# EAGLE design untitled (EAGLE 9.1.3)

## Sheet 1 of 2
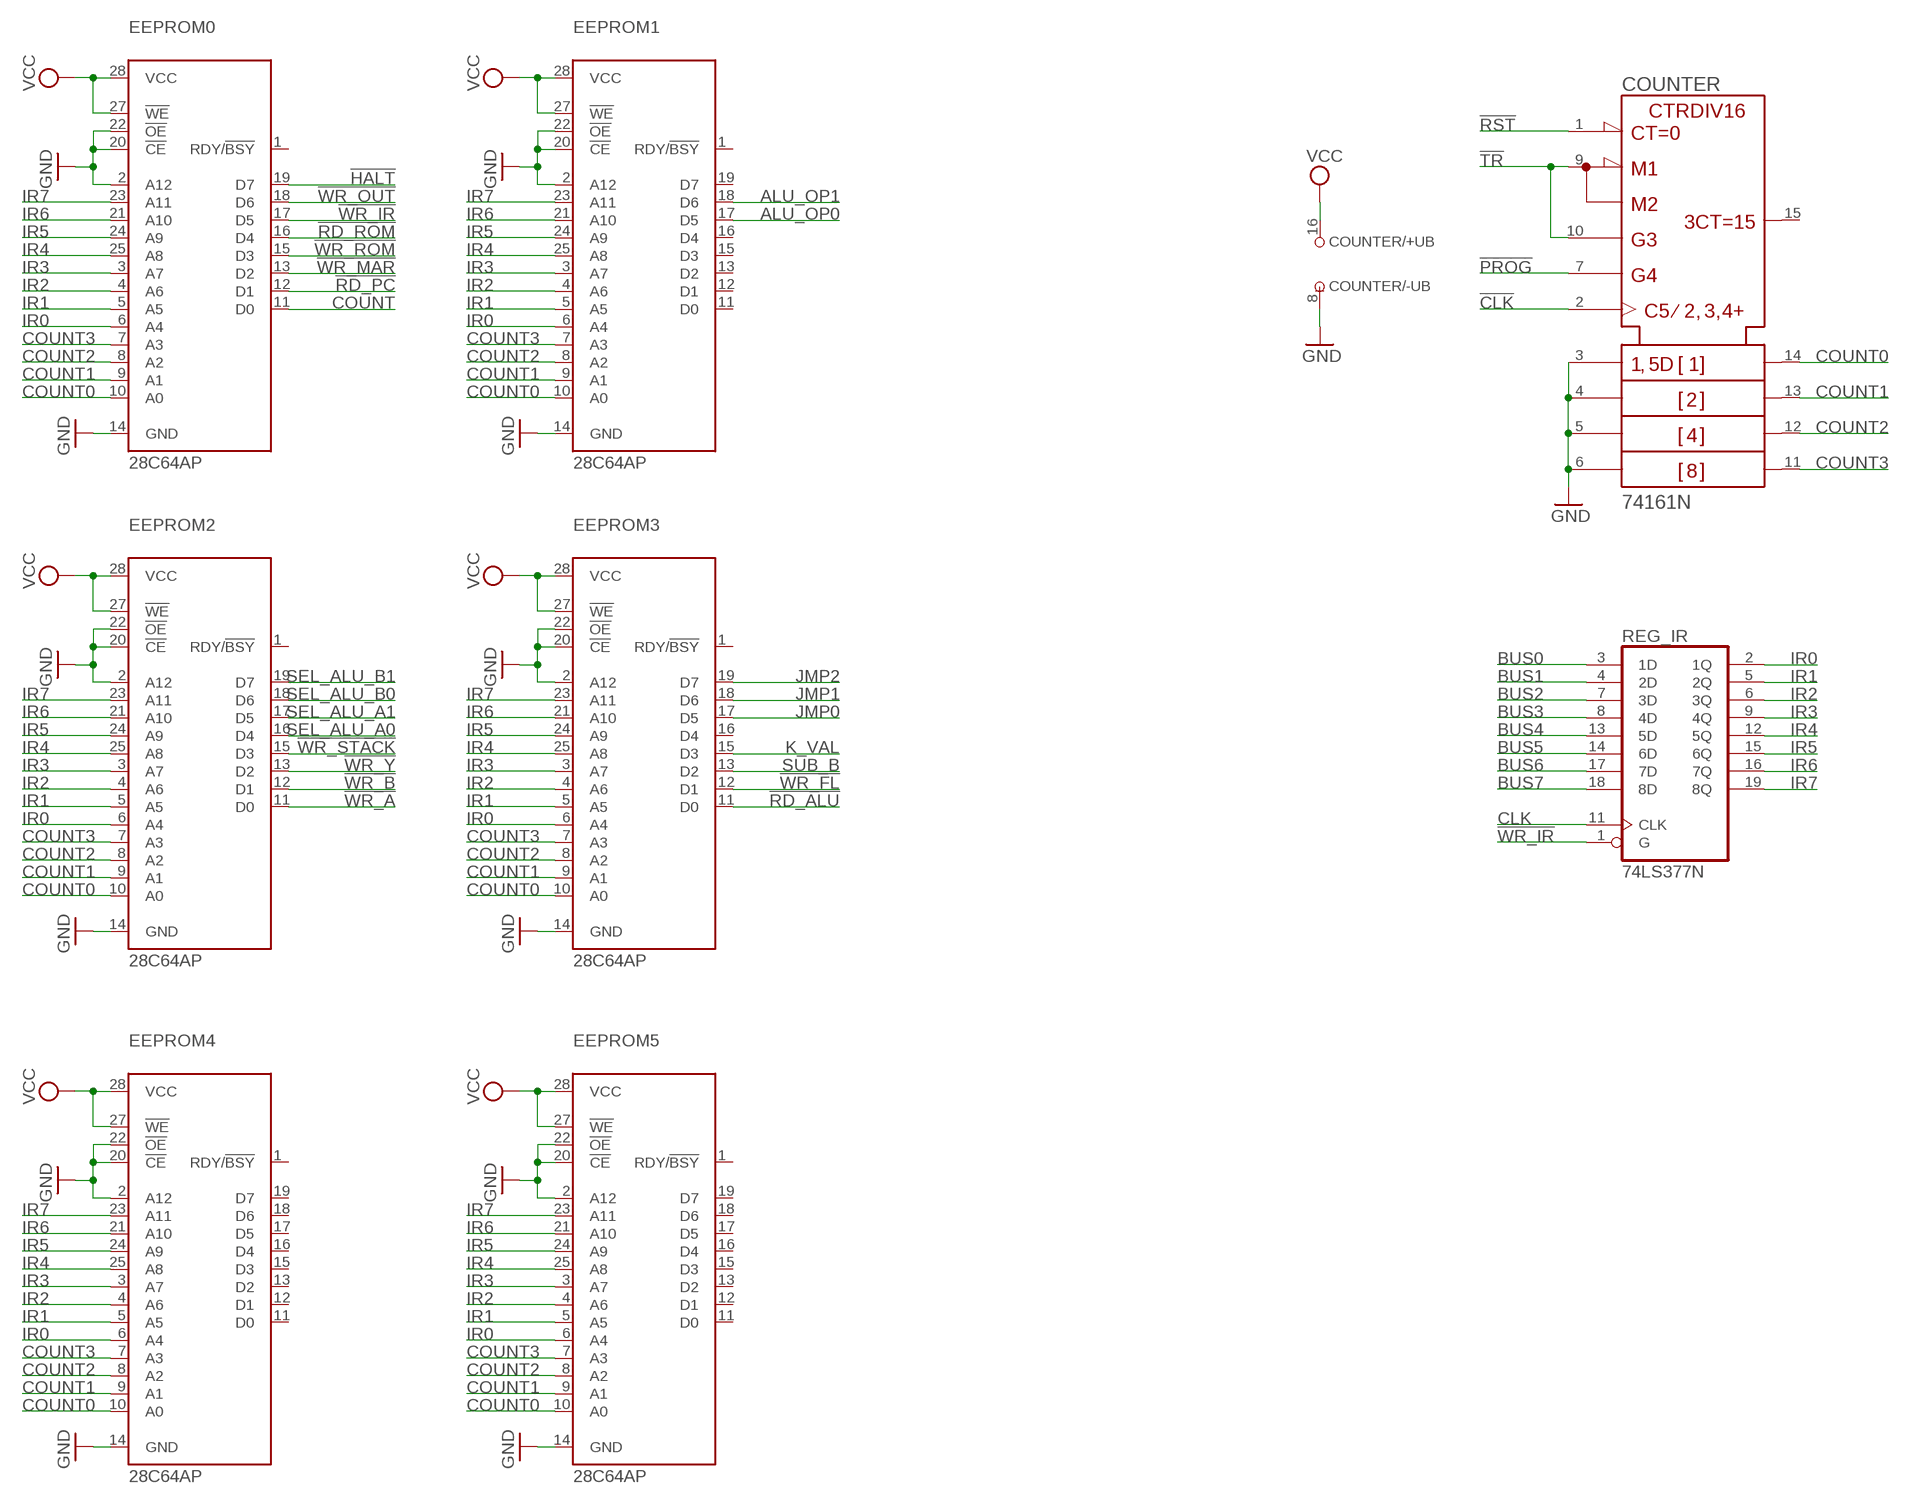
[diagram p0: schematic, sheet 1, part 1 of 2]
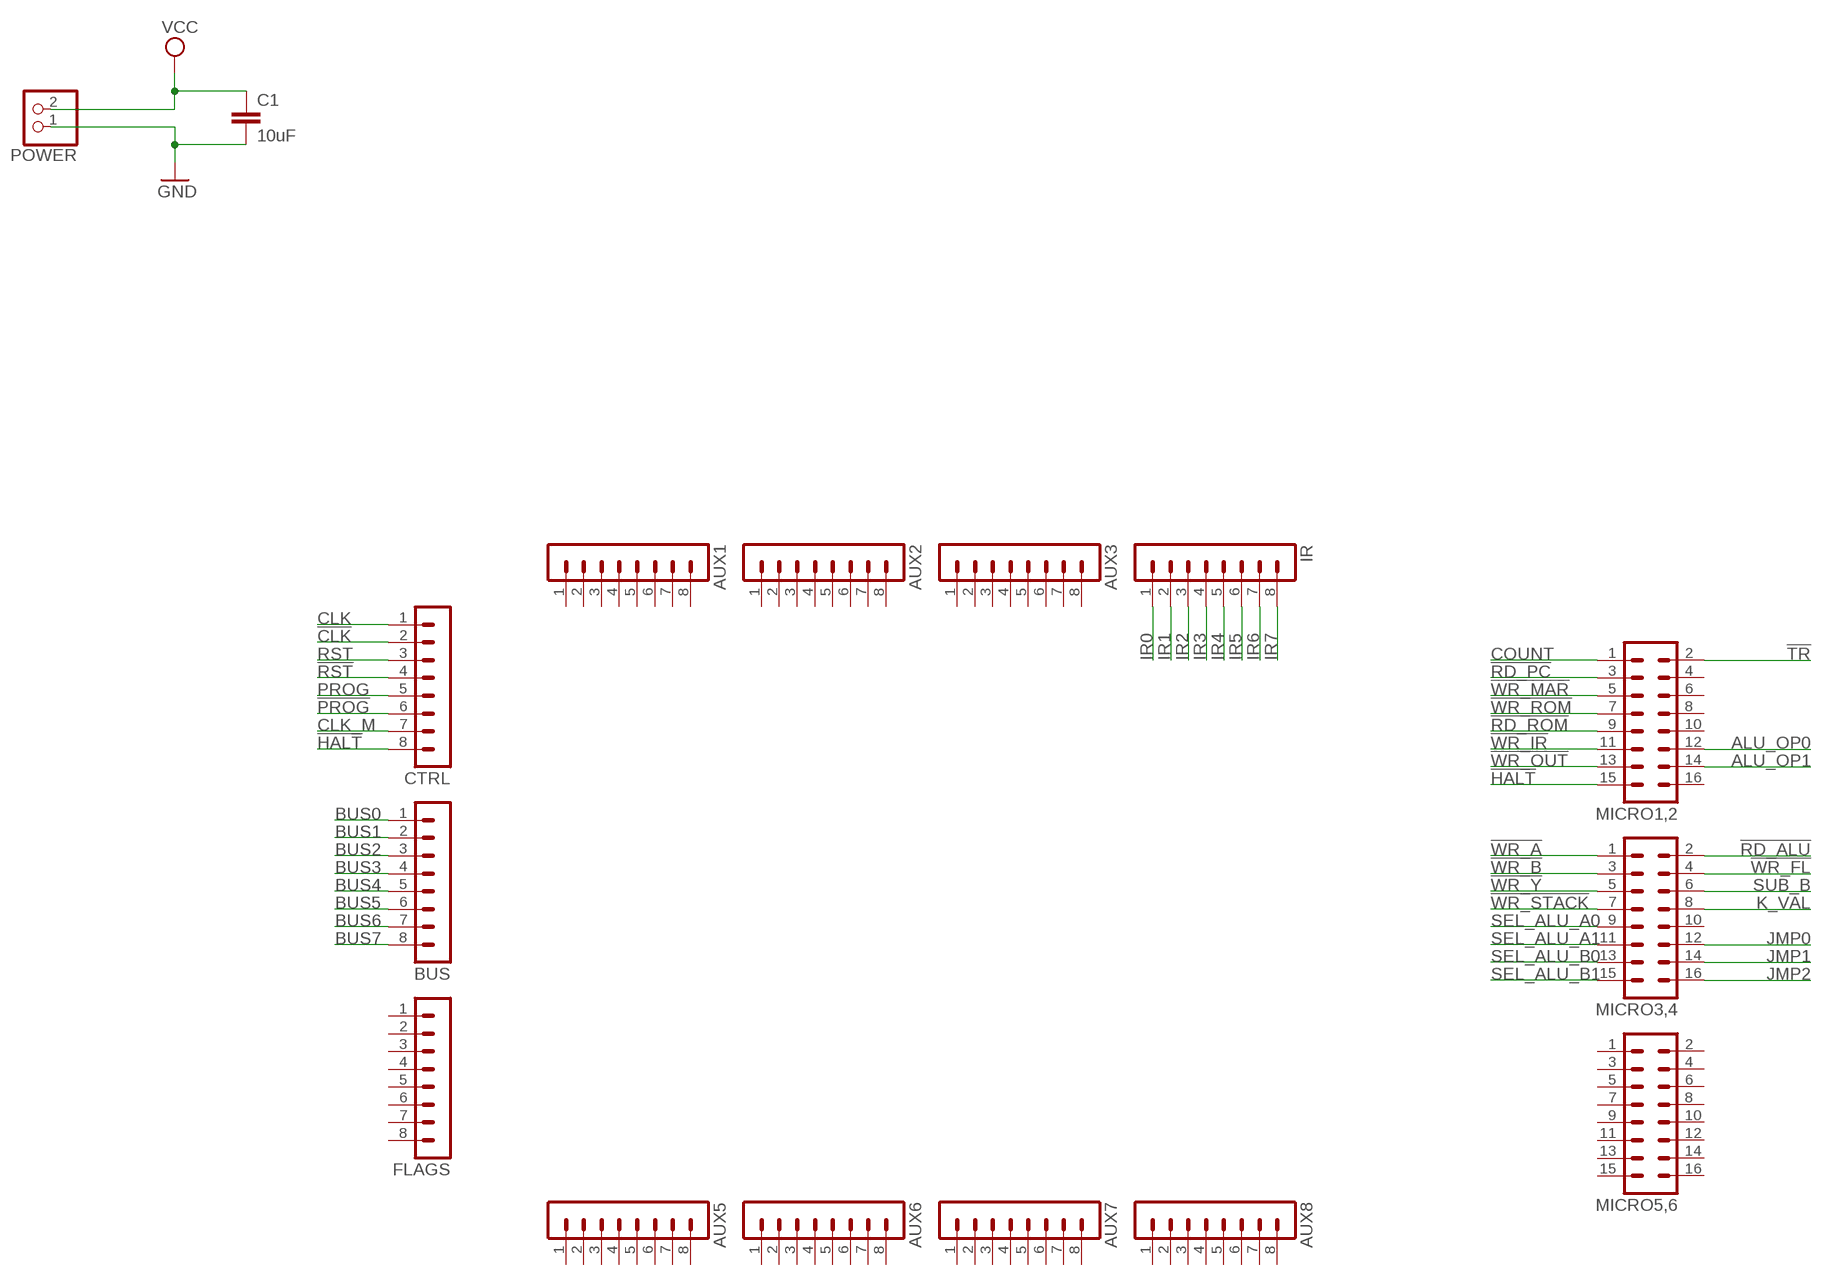
[diagram p1: schematic, sheet 1, part 2 of 2]

### Parts
AUX1  MA08-1  [MA08-1]
AUX2  MA08-1  [MA08-1]
AUX3  MA08-1  [MA08-1]
AUX5  MA08-1  [MA08-1]
AUX6  MA08-1  [MA08-1]
AUX7  MA08-1  [MA08-1]
AUX8  MA08-1  [MA08-1]
BUS  MA08-1  [MA08-1]
C1  10uF  C-EU025-050X050  [C025-050X050]
COUNTER  74161N  [DIL16]
CTRL  MA08-1  [MA08-1]
EEPROM0  28C64AP  [DIL28-6]
EEPROM1  28C64AP  [DIL28-6]
EEPROM2  28C64AP  [DIL28-6]
EEPROM3  28C64AP  [DIL28-6]
EEPROM4  28C64AP  [DIL28-6]
EEPROM5  28C64AP  [DIL28-6]
FLAGS  MA08-1  [MA08-1]
IR  MA08-1  [MA08-1]
MICRO1,2  MA08-2  [MA08-2]
MICRO3,4  MA08-2  [MA08-2]
MICRO5,6  MA08-2  [MA08-2]
POWER  PINHD-1X2  [1X02]
REG_IR  74LS377N  [DIL20]

### Nets
!CLK: COUNTER.2(CLK) CTRL.2
!HALT: CTRL.8 EEPROM0.19(D7) MICRO1,2.15
!PROG: COUNTER.7(ENP) CTRL.6
!RD_ALU: EEPROM3.11(D0) MICRO3,4.2
!RD_PC: EEPROM0.12(D1) MICRO1,2.3
!RD_ROM: EEPROM0.16(D4) MICRO1,2.9
!RST: COUNTER.1(!CLR) CTRL.4
!TR: COUNTER.9(!LOAD) COUNTER.10(ENT) MICRO1,2.2
!WR_A: EEPROM2.11(D0) MICRO3,4.1
!WR_B: EEPROM2.12(D1) MICRO3,4.3
!WR_FL: EEPROM3.12(D1) MICRO3,4.4
!WR_IR: EEPROM0.17(D5) MICRO1,2.11 REG_IR.1(G)
!WR_MAR: EEPROM0.13(D2) MICRO1,2.5
!WR_OUT: EEPROM0.18(D6) MICRO1,2.13
!WR_ROM: EEPROM0.15(D3) MICRO1,2.7
!WR_STACK: EEPROM2.15(D3) MICRO3,4.7
!WR_Y: EEPROM2.13(D2) MICRO3,4.5
ALU_OP0: EEPROM1.17(D5) MICRO1,2.12
ALU_OP1: EEPROM1.18(D6) MICRO1,2.14
BUS0: BUS.1 REG_IR.3(1D)
BUS1: BUS.2 REG_IR.4(2D)
BUS2: BUS.3 REG_IR.7(3D)
BUS3: BUS.4 REG_IR.8(4D)
BUS4: BUS.5 REG_IR.13(5D)
BUS5: BUS.6 REG_IR.14(6D)
BUS6: BUS.7 REG_IR.17(7D)
BUS7: BUS.8 REG_IR.18(8D)
CLK: CTRL.1 REG_IR.11(CLK)
CLK_M: CTRL.7
COUNT: EEPROM0.11(D0) MICRO1,2.1
COUNT0: COUNTER.14(QA) EEPROM0.10(A0) EEPROM1.10(A0) EEPROM2.10(A0) EEPROM3.10(A0) EEPROM4.10(A0) EEPROM5.10(A0)
COUNT1: COUNTER.13(QB) EEPROM0.9(A1) EEPROM1.9(A1) EEPROM2.9(A1) EEPROM3.9(A1) EEPROM4.9(A1) EEPROM5.9(A1)
COUNT2: COUNTER.12(QC) EEPROM0.8(A2) EEPROM1.8(A2) EEPROM2.8(A2) EEPROM3.8(A2) EEPROM4.8(A2) EEPROM5.8(A2)
COUNT3: COUNTER.11(QD) EEPROM0.7(A3) EEPROM1.7(A3) EEPROM2.7(A3) EEPROM3.7(A3) EEPROM4.7(A3) EEPROM5.7(A3)
GND: C1.2 COUNTER.3(A) COUNTER.4(B) COUNTER.5(C) COUNTER.6(D) COUNTER.8(-UB) EEPROM0.2(A12) EEPROM0.14(GND) EEPROM0.20(!CE) EEPROM0.22(!OE) EEPROM1.2(A12) EEPROM1.14(GND) EEPROM1.20(!CE) EEPROM1.22(!OE) EEPROM2.2(A12) EEPROM2.14(GND) EEPROM2.20(!CE) EEPROM2.22(!OE) EEPROM3.2(A12) EEPROM3.14(GND) EEPROM3.20(!CE) EEPROM3.22(!OE) EEPROM4.2(A12) EEPROM4.14(GND) EEPROM4.20(!CE) EEPROM4.22(!OE) EEPROM5.2(A12) EEPROM5.14(GND) EEPROM5.20(!CE) EEPROM5.22(!OE) POWER.1
IR0: EEPROM0.6(A4) EEPROM1.6(A4) EEPROM2.6(A4) EEPROM3.6(A4) EEPROM4.6(A4) EEPROM5.6(A4) IR.1 REG_IR.2(1Q)
IR1: EEPROM0.5(A5) EEPROM1.5(A5) EEPROM2.5(A5) EEPROM3.5(A5) EEPROM4.5(A5) EEPROM5.5(A5) IR.2 REG_IR.5(2Q)
IR2: EEPROM0.4(A6) EEPROM1.4(A6) EEPROM2.4(A6) EEPROM3.4(A6) EEPROM4.4(A6) EEPROM5.4(A6) IR.3 REG_IR.6(3Q)
IR3: EEPROM0.3(A7) EEPROM1.3(A7) EEPROM2.3(A7) EEPROM3.3(A7) EEPROM4.3(A7) EEPROM5.3(A7) IR.4 REG_IR.9(4Q)
IR4: EEPROM0.25(A8) EEPROM1.25(A8) EEPROM2.25(A8) EEPROM3.25(A8) EEPROM4.25(A8) EEPROM5.25(A8) IR.5 REG_IR.12(5Q)
IR5: EEPROM0.24(A9) EEPROM1.24(A9) EEPROM2.24(A9) EEPROM3.24(A9) EEPROM4.24(A9) EEPROM5.24(A9) IR.6 REG_IR.15(6Q)
IR6: EEPROM0.21(A10) EEPROM1.21(A10) EEPROM2.21(A10) EEPROM3.21(A10) EEPROM4.21(A10) EEPROM5.21(A10) IR.7 REG_IR.16(7Q)
IR7: EEPROM0.23(A11) EEPROM1.23(A11) EEPROM2.23(A11) EEPROM3.23(A11) EEPROM4.23(A11) EEPROM5.23(A11) IR.8 REG_IR.19(8Q)
JMP0: EEPROM3.17(D5) MICRO3,4.12
JMP1: EEPROM3.18(D6) MICRO3,4.14
JMP2: EEPROM3.19(D7) MICRO3,4.16
K_VAL: EEPROM3.15(D3) MICRO3,4.8
PROG: CTRL.5
RST: CTRL.3
SEL_ALU_A0: EEPROM2.16(D4) MICRO3,4.9
SEL_ALU_A1: EEPROM2.17(D5) MICRO3,4.11
SEL_ALU_B0: EEPROM2.18(D6) MICRO3,4.13
SEL_ALU_B1: EEPROM2.19(D7) MICRO3,4.15
SUB_B: EEPROM3.13(D2) MICRO3,4.6
VCC: C1.1 COUNTER.16(+UB) EEPROM0.27(!WE) EEPROM0.28(VCC) EEPROM1.27(!WE) EEPROM1.28(VCC) EEPROM2.27(!WE) EEPROM2.28(VCC) EEPROM3.27(!WE) EEPROM3.28(VCC) EEPROM4.27(!WE) EEPROM4.28(VCC) EEPROM5.27(!WE) EEPROM5.28(VCC) POWER.2
Unconnected: AUX1.1 AUX1.2 AUX1.3 AUX1.4 AUX1.5 AUX1.6 AUX1.7 AUX1.8 AUX2.1 AUX2.2 AUX2.3 AUX2.4 AUX2.5 AUX2.6 AUX2.7 AUX2.8 AUX3.1 AUX3.2 AUX3.3 AUX3.4 AUX3.5 AUX3.6 AUX3.7 AUX3.8 AUX5.1 AUX5.2 AUX5.3 AUX5.4 AUX5.5 AUX5.6 AUX5.7 AUX5.8 AUX6.1 AUX6.2 AUX6.3 AUX6.4 AUX6.5 AUX6.6 AUX6.7 AUX6.8 AUX7.1 AUX7.2 AUX7.3 AUX7.4 AUX7.5 AUX7.6 AUX7.7 AUX7.8 AUX8.1 AUX8.2 AUX8.3 AUX8.4 AUX8.5 AUX8.6 AUX8.7 AUX8.8 COUNTER.15(RCO) EEPROM0.1(RDY/!BSY) EEPROM1.1(RDY/!BSY) EEPROM1.11(D0) EEPROM1.12(D1) EEPROM1.13(D2) EEPROM1.15(D3) EEPROM1.16(D4) EEPROM1.19(D7) EEPROM2.1(RDY/!BSY) EEPROM3.1(RDY/!BSY) EEPROM3.16(D4) EEPROM4.1(RDY/!BSY) EEPROM4.11(D0) EEPROM4.12(D1) EEPROM4.13(D2) EEPROM4.15(D3) EEPROM4.16(D4) EEPROM4.17(D5) EEPROM4.18(D6) EEPROM4.19(D7) EEPROM5.1(RDY/!BSY) EEPROM5.11(D0) EEPROM5.12(D1) EEPROM5.13(D2) EEPROM5.15(D3) EEPROM5.16(D4) EEPROM5.17(D5) EEPROM5.18(D6) EEPROM5.19(D7) FLAGS.1 FLAGS.2 FLAGS.3 FLAGS.4 FLAGS.5 FLAGS.6 FLAGS.7 FLAGS.8 MICRO1,2.4 MICRO1,2.6 MICRO1,2.8 MICRO1,2.10 MICRO1,2.16 MICRO3,4.10 MICRO5,6.1 MICRO5,6.2 MICRO5,6.3 MICRO5,6.4 MICRO5,6.5 MICRO5,6.6 MICRO5,6.7 MICRO5,6.8 MICRO5,6.9 MICRO5,6.10 MICRO5,6.11 MICRO5,6.12 MICRO5,6.13 MICRO5,6.14 MICRO5,6.15 MICRO5,6.16

## Sheet 2 of 2

## Power pins joined to a net without a drawn wire
GND: REG_IR.10(GND)
VCC: REG_IR.20(VCC)

## Library data of the parts
AUX1-AUX3 AUX5-AUX8 BUS CTRL FLAGS IR = con-lstb:MA08-1: PIN HEADER; OC_FARNELL: unknown; OC_NEWARK: unknown
C1 = rcl:C-EU: CAPACITOR, European symbol; SPICEPREFIX: C
COUNTER = 74ttl-din:74*161: Synchrounus 4-bit COUNTER
EEPROM0 EEPROM1-EEPROM5 = microchip:28*64A: CMOS EEPROM 64 K (8 K x 8), low voltage; MPN: AT28C64B-15PU; OC_FARNELL: 1631144; OC_NEWARK: 96K6557
MICRO1,2 MICRO3,4 MICRO5,6 = con-lstb:MA08-2: PIN HEADER; OC_FARNELL: unknown; OC_NEWARK: unknown
POWER = pinhead:PINHD-1X2: PIN HEADER
REG_IR = 74xx-eu:74*377: Octal D type FLIP FLOP, enable

## Board
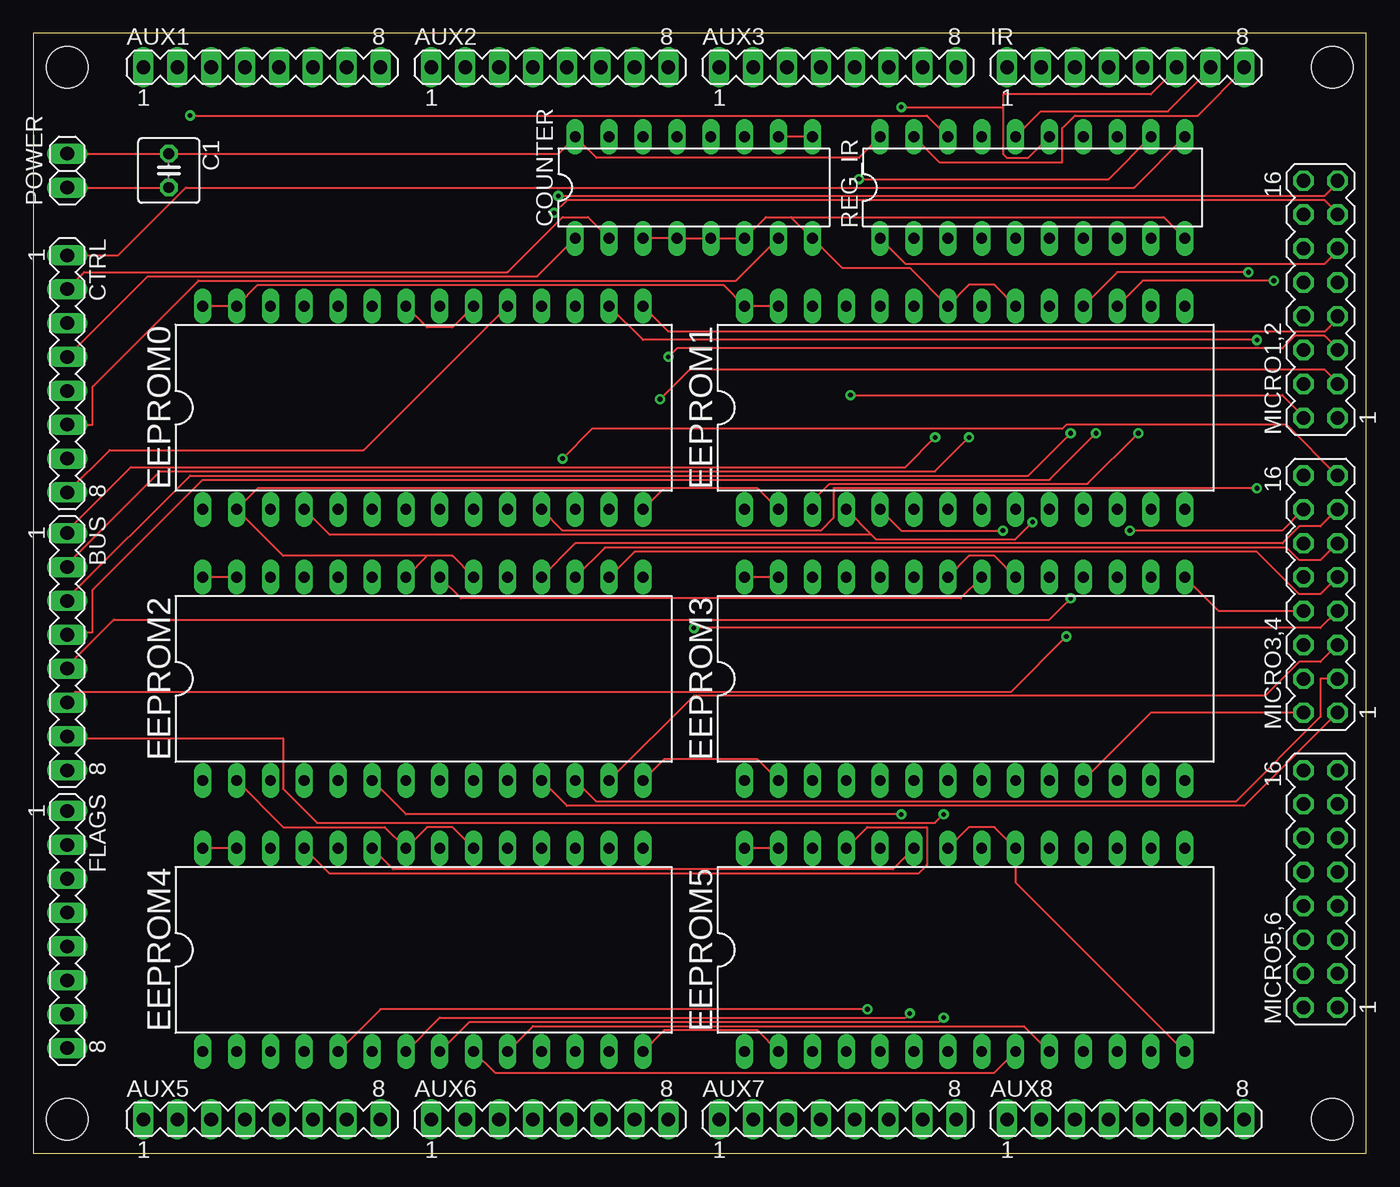
[diagram p2: board, top side]
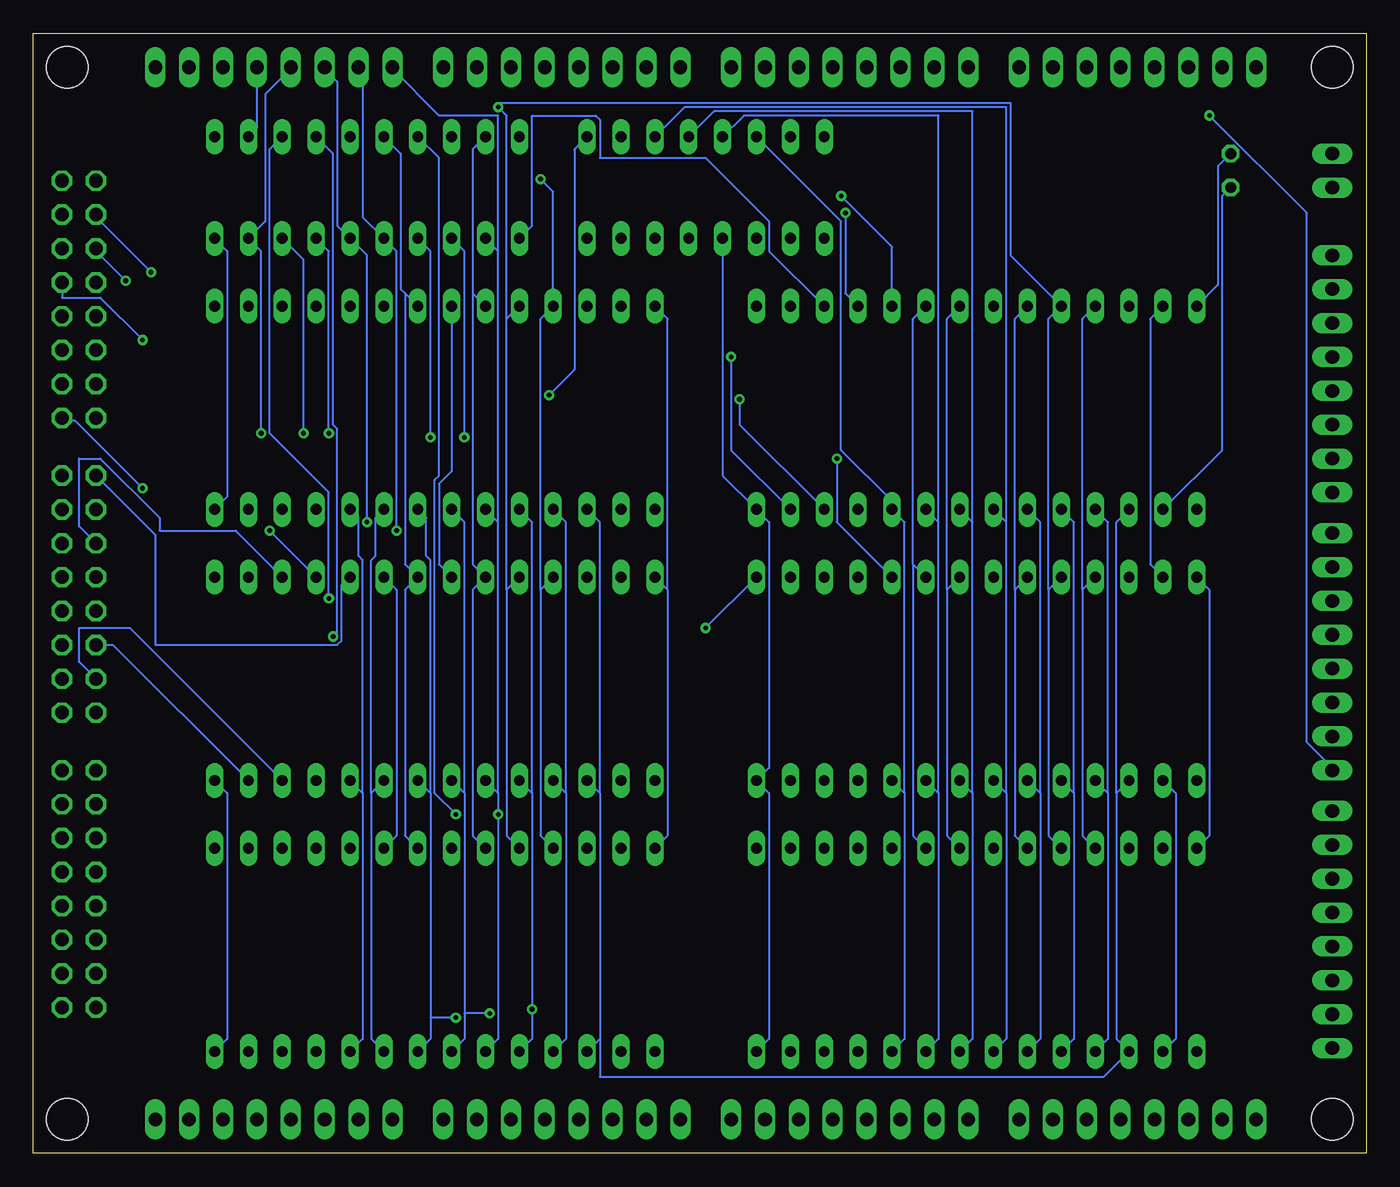
[diagram p3: board, bottom side, seen from below]

Size 99.95 x 83.95 mm. Coordinates in mm from the lower left corner, seen from the top.
Outline: 0,0 99.95,0 99.95,83.95 0,83.95 0,0
Copper layers (1*16): Top 0.035mm / dielectric 1.5mm / Bottom 0.035mm
Design rules "default": minimum track width 6mil, minimum drill 0.35mm, track to track 6mil, track to pad 6mil, pad to pad 6mil, via to via 6mil, smd to smd 6mil, copper to edge 40mil, drill to drill 6mil, minimum pad ring 10mil, minimum via ring 8mil, stop-mask expansion 4mil, vias tented up to drill 0mil, thermal gap 10mil
Holes 3.1 mm at 97.41,81.41 2.54,81.41 97.41,2.54 2.54,2.54

### Footprints (pad centres in the part's own frame; a part is rotated, then mirrored left to right if it is on the bottom)
MA08-1 = drill 1.016 long: 1 -8.89,0; 2 -6.35,0; 3 -3.81,0; 4 -1.27,0; 5 1.27,0; 6 3.81,0; 7 6.35,0; 8 8.89,0
C025-050X050 = drill 0.813 octagon: 1 -1.27,0; 2 1.27,0
DIL16 = drill 0.813 long: 1 -8.89,-3.81; 2 -6.35,-3.81; 3 -3.81,-3.81; 4 -1.27,-3.81; 5 1.27,-3.81; 6 3.81,-3.81; 7 6.35,-3.81; 8 8.89,-3.81; 9 8.89,3.81; 10 6.35,3.81; 11 3.81,3.81; 12 1.27,3.81; 13 -1.27,3.81; 14 -3.81,3.81; 15 -6.35,3.81; 16 -8.89,3.81
DIL28-6 = drill 0.813 long: 1 -16.51,-7.62; 2 -13.97,-7.62; 3 -11.43,-7.62; 4 -8.89,-7.62; 5 -6.35,-7.62; 6 -3.81,-7.62; 7 -1.27,-7.62; 8 1.27,-7.62; 9 3.81,-7.62; 10 6.35,-7.62; 11 8.89,-7.62; 12 11.43,-7.62; 13 13.97,-7.62; 14 16.51,-7.62; 15 16.51,7.62; 16 13.97,7.62; 17 11.43,7.62; 18 8.89,7.62; 19 6.35,7.62; 20 3.81,7.62; 21 1.27,7.62; 22 -1.27,7.62; 23 -3.81,7.62; 24 -6.35,7.62; 25 -8.89,7.62; 26 -11.43,7.62; 27 -13.97,7.62; 28 -16.51,7.62
MA08-2 = drill 1.016 octagon: 1 -8.89,-1.27; 2 -8.89,1.27; 3 -6.35,-1.27; 4 -6.35,1.27; 5 -3.81,-1.27; 6 -3.81,1.27; 7 -1.27,-1.27; 8 -1.27,1.27; 9 1.27,-1.27; 10 1.27,1.27; 11 3.81,-1.27; 12 3.81,1.27; 13 6.35,-1.27; 14 6.35,1.27; 15 8.89,-1.27; 16 8.89,1.27
1X02 = drill 1.016 long: 1 -1.27,0; 2 1.27,0
DIL20 = drill 0.813 long: 1 -11.43,-3.81; 2 -8.89,-3.81; 3 -6.35,-3.81; 4 -3.81,-3.81; 5 -1.27,-3.81; 6 1.27,-3.81; 7 3.81,-3.81; 8 6.35,-3.81; 9 8.89,-3.81; 10 11.43,-3.81; 11 11.43,3.81; 12 8.89,3.81; 13 6.35,3.81; 14 3.81,3.81; 15 1.27,3.81; 16 -1.27,3.81; 17 -3.81,3.81; 18 -6.35,3.81; 19 -8.89,3.81; 20 -11.43,3.81

### Placement (x,y rotation side)
AUX1  17.14,81.41 0 top
AUX2  38.73,81.41 0 top
AUX3  60.33,81.41 0 top
AUX5  17.14,2.54 0 top
AUX6  38.73,2.54 0 top
AUX7  60.33,2.54 0 top
AUX8  81.92,2.54 0 top
BUS  2.54,37.59 270 top
C1  10.16,73.66 270 top
COUNTER  49.53,72.39 0 top
CTRL  2.54,58.42 270 top
EEPROM0  29.21,55.88 0 top
EEPROM1  69.85,55.88 0 top
EEPROM2  29.21,35.56 0 top
EEPROM3  69.85,35.56 0 top
EEPROM4  29.21,15.24 0 top
EEPROM5  69.85,15.24 0 top
FLAGS  2.54,16.76 270 top
IR  81.92,81.41 0 top
MICRO1,2  96.52,64.01 90 top
MICRO3,4  96.52,41.91 90 top
MICRO5,6  96.52,19.81 90 top
POWER  2.54,73.66 90 top
REG_IR  74.93,72.39 0 top

### Tracks (layer width: path | path; a pad name or v marks a point on that pad's centre or on a via)
!CLK
  Top 0.152: COUNTER.2 41.59,70.17 39.69,70.17 35.56,66.04 3.81,66.04 CTRL.2
!HALT  (via drill 0.35)
  Top 0.152: EEPROM0.19 24.77,52.7 5.71,52.7 CTRL.8 | v39.37,71.75 96.84,71.75 97.79,72.71 MICRO1,2.15
  Bottom 0.152: v39.37,71.75 35.56,67.94 EEPROM0.19
!PROG
  Top 0.152: COUNTER.7 52.7,65.41 12.38,65.41 4.45,57.47 4.45,54.61 CTRL.6
!RD_ALU
  Top 0.152: EEPROM3.11 83.82,33.02 MICRO3,4.2
!RD_PC  (via drill 0.35)
  Top 0.152: v46.99,56.52 49.21,58.74 96.84,58.74 97.79,57.78 MICRO1,2.3
  Bottom 0.152: EEPROM0.12 46.99,54.61 v46.99,56.52
!RD_ROM  (via drill 0.35)
  Top 0.152: EEPROM0.16 45.72,60.96 v91.76,60.96
  Bottom 0.152: v91.76,60.96 94.93,64.14 97.79,64.14 MICRO1,2.9
!RST
  Top 0.152: COUNTER.1 37.78,65.72 8.57,65.72 CTRL.4
!TR  (via drill 0.35)
  Top 0.152: COUNTER.9 COUNTER.10 | v61.28,56.83 93.66,56.83 95.25,55.24 MICRO1,2.2
  Bottom 0.152: v61.28,56.83 59.37,58.74 59.37,75.25 COUNTER.9
!WR_A
  Top 0.152: EEPROM2.11 40.01,26.04 90.81,26.04 MICRO3,4.1
!WR_B
  Top 0.152: EEPROM2.12 42.23,26.35 90.17,26.35 96.52,32.7 96.52,35.56 MICRO3,4.3
!WR_FL
  Bottom 0.152: EEPROM3.12 92.71,39.37 96.52,39.37 96.52,36.83 MICRO3,4.4
!WR_IR
  Top 0.152: REG_IR.1 65.41,66.67 96.84,66.67 97.79,67.63 MICRO1,2.11
  Bottom 0.152: EEPROM0.17 44.77,67.63 44.77,69.85 49.53,74.61 57.47,74.61 57.47,77.47 57.78,77.79 62.55,77.79 62.55,69.53 REG_IR.1
!WR_MAR  (via drill 0.35)
  Top 0.152: v47.62,59.69 48.26,60.33 93.66,60.33 94.61,61.28 96.84,61.28 97.79,60.33 MICRO1,2.5
  Bottom 0.152: EEPROM0.13 47.62,52.7 v47.62,59.69
!WR_OUT  (via drill 0.35)
  Top 0.152: v39.05,70.48 40.01,71.44 96.84,71.44 97.79,70.48 MICRO1,2.13
  Bottom 0.152: EEPROM0.18 39.05,64.45 v39.05,70.48
!WR_ROM
  Top 0.152: EEPROM0.15 47.62,61.59 96.84,61.59 97.79,62.55 MICRO1,2.7
!WR_STACK  (via drill 0.35)
  Top 0.152: v49.53,39.37 96.52,39.37 MICRO3,4.7
  Bottom 0.152: v49.53,39.37 EEPROM2.15
!WR_Y
  Top 0.152: EEPROM2.13 49.53,34.29 92.39,34.29 94.93,36.83 96.52,36.83 MICRO3,4.5
ALU_OP0  (via drill 0.35)
  Top 0.152: EEPROM1.17 83.19,65.41 v93.03,65.41
  Bottom 0.152: v93.03,65.41 95.25,67.63 MICRO1,2.12
ALU_OP1  (via drill 0.35)
  Top 0.152: EEPROM1.18 81.28,66.04 v91.12,66.04
  Bottom 0.152: v91.12,66.04 95.25,70.17 MICRO1,2.14
BUS0  (via drill 0.35)
  Top 0.152: v67.63,53.66 65.41,51.44 7.3,51.44 2.54,46.67 BUS.1
  Bottom 0.152: REG_IR.3 67.63,67.63 v67.63,53.66
BUS1  (via drill 0.35)
  Top 0.152: v70.17,53.66 67.63,51.12 9.53,51.12 2.54,44.13 BUS.2
  Bottom 0.152: REG_IR.4 70.17,67.63 v70.17,53.66
BUS2  (via drill 0.35)
  Top 0.152: v77.79,53.98 74.61,50.8 11.75,50.8 2.54,41.59 BUS.3
  Bottom 0.152: REG_IR.7 77.79,67.63 v77.79,53.98
BUS3  (via drill 0.35)
  Top 0.152: v79.69,53.98 76.2,50.48 12.7,50.48 4.45,42.23 4.45,39.05 2.54,39.05 BUS.4
  Bottom 0.152: REG_IR.8 79.69,66.99 v79.69,53.98
BUS4  (via drill 0.35)
  Top 0.152: v77.79,41.59 76.2,40.01 6.03,40.01 2.54,36.51 BUS.5
  Bottom 0.152: REG_IR.13 82.23,75.25 82.23,53.98 77.79,49.53 v77.79,41.59
BUS5  (via drill 0.35)
  Top 0.152: v77.47,38.73 73.34,34.61 3.17,34.61 2.54,33.97 BUS.6
  Bottom 0.152: REG_IR.14 77.47,74.93 77.47,54.61 77.15,54.29 77.15,39.05 v77.47,38.73
BUS6  (via drill 0.35)
  Top 0.152: v68.26,25.4 67.63,24.77 21.27,24.77 18.73,27.3 18.73,31.11 2.54,31.11 BUS.7
  Bottom 0.152: REG_IR.17 69.53,74.61 69.53,50.8 69.85,50.48 69.85,26.99 v68.26,25.4
BUS7  (via drill 0.35)
  Top 0.152: REG_IR.18 66.99,77.79 v11.75,77.79
  Bottom 0.152: v11.75,77.79 4.45,70.48 4.45,30.8 2.54,28.89 BUS.8
CLK
  Top 0.152: REG_IR.11 82.55,72.39 11.43,72.39 6.35,67.31 CTRL.1
COUNT  (via drill 0.35)
  Top 0.152: EEPROM0.11 39.69,46.67 59.05,46.67 60.01,47.62 60.01,49.85 v91.76,49.85
  Bottom 0.152: v91.76,49.85 96.84,54.93 97.79,54.93 MICRO1,2.1
COUNT0
  Top 0.152: EEPROM5.10 74.3,9.53 37.47,9.53 EEPROM4.10
  Bottom 0.152: EEPROM5.10 75.25,8.57 75.25,26.99 | EEPROM3.10 75.25,26.99 | EEPROM1.10 75.56,47.62 75.56,44.77 75.25,44.45 75.25,26.99 | EEPROM4.10 34.61,8.57 34.61,26.99 | EEPROM2.10 34.61,26.99 | 34.61,26.99 34.61,47.31 EEPROM0.10 35.56,48.9 39.37,52.7 39.37,69.85 COUNTER.14
COUNT1
  Top 0.152: EEPROM5.9 72.07,6.03 34.61,6.03 EEPROM4.9
  Bottom 0.152: EEPROM5.9 74.61,8.57 74.61,26.99 | EEPROM3.9 74.61,26.99 | EEPROM1.9 74.3,47.62 74.3,44.77 74.61,44.45 74.61,26.99 | EEPROM4.9 32.07,8.57 32.07,26.99 | EEPROM2.9 32.07,26.99 | 32.07,47.31 EEPROM0.9 | 32.07,26.99 32.07,47.31 | COUNTER.13 46.67,77.79 32.07,77.79 32.07,47.31
COUNT2  (via drill 0.35)
  Top 0.152: v68.26,10.16 67.94,9.84 32.7,9.84 EEPROM4.8
  Bottom 0.152: EEPROM5.8 70.17,8.57 70.17,10.16 | 70.17,26.99 70.17,10.16 | EEPROM3.8 70.17,26.99 | EEPROM1.8 70.48,47.62 70.48,44.77 70.17,44.45 70.17,26.99 | EEPROM4.8 29.53,8.57 29.53,26.99 | EEPROM2.8 29.53,26.99 | 29.53,47.31 EEPROM0.8 | 29.53,26.99 29.53,47.31 | COUNTER.12 48.9,78.11 29.53,78.11 29.53,47.31 | v68.26,10.16 70.17,10.16
COUNT3  (via drill 0.35)
  Top 0.152: v65.72,10.48 65.41,10.16 30.48,10.16 EEPROM4.7
  Bottom 0.152: EEPROM5.7 67.63,8.57 67.63,10.48 | 67.63,26.99 67.63,10.48 | EEPROM3.7 67.63,26.99 | EEPROM1.7 67.63,47.31 67.63,26.99 | EEPROM4.7 26.99,8.57 26.99,26.99 | EEPROM2.7 26.99,26.99 | 26.99,47.31 EEPROM0.7 | 26.99,26.99 26.99,47.31 | COUNTER.11 51.12,78.42 26.99,78.42 26.99,47.31 | v65.72,10.48 67.63,10.48
GND
  Top 0.152: EEPROM4.20 31.43,24.45 29.53,24.45 EEPROM4.22 26.35,24.45 18.73,24.45 EEPROM2.2 | POWER.1 C1.2 | EEPROM0.22 29.53,61.91 31.43,61.91 EEPROM0.20 | 29.53,44.77 EEPROM2.22 | 29.53,44.77 31.43,44.77 EEPROM2.20 | 29.53,44.77 18.73,44.77 EEPROM0.2 16.83,49.85 47.31,49.85 | EEPROM5.22 70.17,24.45 72.07,24.45 EEPROM5.20 73.66,20.32 EEPROM5.14 | EEPROM3.22 70.17,44.77 72.07,44.77 EEPROM3.20 | EEPROM4.14 47.31,9.21 54.29,9.21 EEPROM5.2 | EEPROM2.14 47.31,29.53 54.29,29.53 EEPROM3.2 | 47.31,49.85 EEPROM0.14 | 47.31,49.85 54.29,49.85 EEPROM1.2 | EEPROM1.20 72.07,65.09 70.17,65.09 EEPROM1.22 65.72,66.36 60.64,66.36 COUNTER.8 56.83,70.17 | COUNTER.3 COUNTER.4 COUNTER.5 COUNTER.6 54.93,70.17 56.83,70.17 | REG_IR.10 84.77,70.17 56.83,70.17
  Bottom 0.152: EEPROM4.2 14.29,8.57 14.29,26.99 EEPROM2.2 | EEPROM0.20 33.97,62.55 33.97,44.13 | EEPROM2.20 33.97,44.13 | C1.2 10.79,71.75 10.79,52.7 EEPROM0.2 | EEPROM4.20 33.97,23.81 33.97,44.13 | EEPROM5.14 85.41,8.57 85.41,26.99 EEPROM3.14 | EEPROM5.20 72.71,23.81 72.71,42.23 EEPROM3.20 | EEPROM4.14 44.77,8.57 44.77,26.99 EEPROM2.14 44.77,28.89 44.77,47.31 EEPROM0.14 48.26,50.8 COUNTER.4 | EEPROM1.14 85.41,49.21 85.41,67.63 REG_IR.10 | EEPROM3.22 69.53,44.13 69.53,50.16 68.58,51.12 EEPROM1.22
IR0  (via drill 0.35)
  Top 0.152: EEPROM2.6 27.94,25.4 v65.09,25.4
  Bottom 0.152: EEPROM4.6 24.45,8.57 24.45,26.99 | EEPROM2.6 24.45,26.99 | EEPROM0.6 24.45,47.31 24.45,26.99 | EEPROM5.6 65.09,8.57 v65.09,25.4 65.09,26.99 | EEPROM3.6 65.09,26.99 | 65.09,47.31 EEPROM1.6 | 65.09,26.99 65.09,47.31 | 65.09,67.63 REG_IR.2 | 65.09,47.31 65.09,67.63 | 65.09,67.63 65.09,77.79 69.53,77.79 73.03,81.28 IR.1
IR1  (via drill 0.35)
  Top 0.152: v72.71,46.67 65.09,46.67 EEPROM1.5 | EEPROM4.5 26.04,10.79 v62.55,10.79
  Bottom 0.152: EEPROM4.5 21.91,8.57 21.91,26.99 | EEPROM2.5 21.91,26.99 | EEPROM0.5 21.91,47.31 21.91,26.99 | IR.2 75.56,81.28 75.25,80.96 75.25,70.17 REG_IR.5 72.71,67.63 v72.71,46.67 | EEPROM5.5 62.55,8.57 v62.55,10.79 62.55,26.99 | EEPROM3.5 62.55,26.99 | EEPROM1.5 62.55,47.31 62.55,26.99
IR2  (via drill 0.35)
  Top 0.152: v74.93,47.31 73.66,46.04 63.18,46.04 62.87,46.35 | EEPROM1.4 62.87,46.35 | EEPROM0.4 22.23,46.35 62.87,46.35
  Bottom 0.152: EEPROM4.4 19.37,8.57 19.37,26.99 | EEPROM2.4 19.37,26.99 | EEPROM0.4 19.37,47.31 19.37,26.99 | IR.3 78.11,81.28 77.15,80.33 77.15,69.53 REG_IR.6 74.93,67.31 v74.93,47.31 | EEPROM5.4 60.01,8.57 60.01,26.99 | EEPROM3.4 60.01,26.99 | EEPROM1.4 60.01,47.31 60.01,26.99
IR3  (via drill 0.35)
  Top 0.152: v82.87,53.98 79.06,50.16 59.69,50.16 58.42,48.9 EEPROM1.3
  Bottom 0.152: 18.73,26.99 18.73,8.57 EEPROM4.3 19.68,5.71 57.47,5.71 57.47,8.57 | EEPROM2.3 18.73,26.99 | EEPROM0.3 18.73,47.31 18.73,26.99 | IR.4 80.64,81.28 82.55,79.38 82.55,69.85 REG_IR.9 82.87,67.63 v82.87,53.98 | 57.47,8.57 EEPROM5.3 | 57.47,26.99 57.47,8.57 | EEPROM3.3 57.47,26.99 | EEPROM1.3 57.47,47.31 57.47,26.99
IR4  (via drill 0.35)
  Top 0.152: REG_IR.12 80.64,73.03 v61.91,73.03 | EEPROM4.25 22.23,20.95 66.36,20.95 66.99,21.59 66.99,24.45 62.55,24.45 EEPROM5.25
  Bottom 0.152: EEPROM4.25 21.27,23.81 21.27,42.23 | EEPROM2.25 21.27,42.23 | EEPROM0.25 21.27,62.55 21.27,42.23 | REG_IR.12 83.19,76.83 IR.5 | EEPROM5.25 61.91,23.81 61.91,42.23 | EEPROM3.25 61.91,42.23 | 61.91,42.23 61.91,62.55 EEPROM1.25 60.96,72.07 v61.91,73.03
IR5  (via drill 0.35)
  Top 0.152: REG_IR.15 74.61,74.61 73.03,74.61 72.71,74.93 72.71,78.42 | 72.71,78.42 72.71,79.38 83.82,79.38 85.72,81.28 IR.6 | v65.09,78.42 72.71,78.42
  Bottom 0.152: EEPROM4.24 23.81,23.81 23.81,42.23 | EEPROM2.24 23.81,42.23 | 23.81,42.23 23.81,62.55 EEPROM0.24 26.67,67.31 26.67,78.74 65.09,78.74 v65.09,78.42 64.45,77.79 64.45,62.55 | EEPROM5.24 64.45,23.81 64.45,42.23 | EEPROM3.24 64.45,42.23 | 64.45,62.55 EEPROM1.24 | 64.45,42.23 64.45,62.55
IR6
  Top 0.152: REG_IR.16 75.56,78.11 85.09,78.11 88.27,81.28 IR.7 | EEPROM2.21 32.07,41.59 69.53,41.59 EEPROM3.21
  Bottom 0.152: EEPROM4.21 31.43,23.81 31.43,42.23 | EEPROM2.21 31.43,42.23 | EEPROM0.21 31.43,62.55 31.43,42.23 | EEPROM5.21 72.07,23.81 72.07,42.23 EEPROM3.21 72.07,44.13 72.07,64.45 | 72.07,64.45 72.39,64.77 72.39,74.93 REG_IR.16 | 72.07,64.45 EEPROM1.21
IR7
  Top 0.152: REG_IR.19 67.94,74.3 77.15,74.3 77.15,76.83 78.11,77.79 87.31,77.79 90.81,81.28 IR.8 | EEPROM4.23 26.99,21.27 64.45,21.27 EEPROM5.23
  Bottom 0.152: EEPROM4.23 26.35,23.81 26.35,42.23 | EEPROM2.23 26.35,42.23 | EEPROM0.23 26.35,62.55 26.35,42.23 | EEPROM5.23 66.99,23.81 66.99,42.23 EEPROM3.23 66.99,44.13 66.99,64.45 | 66.99,64.45 EEPROM1.23 | 66.99,64.45 66.99,75.25 REG_IR.19
JMP0
  Bottom 0.152: EEPROM3.17 84.77,46.67 90.49,46.67 90.49,47.62 94.93,52.07 96.52,52.07 96.52,46.99 MICRO3,4.12
JMP1  (via drill 0.35)
  Top 0.152: v82.23,46.67 93.66,46.67 MICRO3,4.14
  Bottom 0.152: v82.23,46.67 EEPROM3.18
JMP2
  Bottom 0.152: EEPROM3.19 76.83,42.55 76.83,38.42 77.15,38.1 90.81,38.1 90.81,46.35 MICRO3,4.16
K_VAL
  Top 0.152: EEPROM3.15 88.9,40.64 MICRO3,4.8
SEL_ALU_A0
  Top 0.152: EEPROM2.16 45.09,45.09 91.76,45.09 94.93,41.91 96.52,41.91 MICRO3,4.9
SEL_ALU_A1
  Top 0.152: EEPROM2.17 42.86,45.4 93.98,45.4 94.93,44.45 96.52,44.45 MICRO3,4.11
SEL_ALU_B0
  Top 0.152: EEPROM2.18 40.64,45.72 93.66,45.72 94.93,46.99 96.52,46.99 MICRO3,4.13
SEL_ALU_B1  (via drill 0.35)
  Top 0.152: v39.69,52.07 41.91,54.29 77.15,54.29 77.47,54.61 93.98,54.61 MICRO3,4.15
  Bottom 0.152: EEPROM2.19 39.69,47.31 v39.69,52.07
SUB_B
  Bottom 0.152: EEPROM3.13 93.98,38.1 MICRO3,4.6
VCC
  Top 0.152: EEPROM1.27 EEPROM1.28 51.75,65.09 16.83,65.09 EEPROM0.27 EEPROM0.28 | EEPROM5.27 EEPROM5.28 | EEPROM3.27 EEPROM3.28 | REG_IR.20 61.91,74.61 42.23,74.61 COUNTER.16 39.37,74.93 C1.1 POWER.2 | EEPROM4.27 EEPROM4.28 | EEPROM2.27 EEPROM2.28
  Bottom 0.152: EEPROM5.28 52.39,23.81 52.39,42.23 | EEPROM3.28 52.39,42.23 | EEPROM1.28 52.39,62.55 52.39,42.23 | EEPROM4.28 11.75,23.81 11.75,42.23 EEPROM2.28 | EEPROM0.28 11.11,65.09 11.11,73.98 C1.1 | EEPROM2.27 16.19,44.13 16.19,62.55 EEPROM0.27